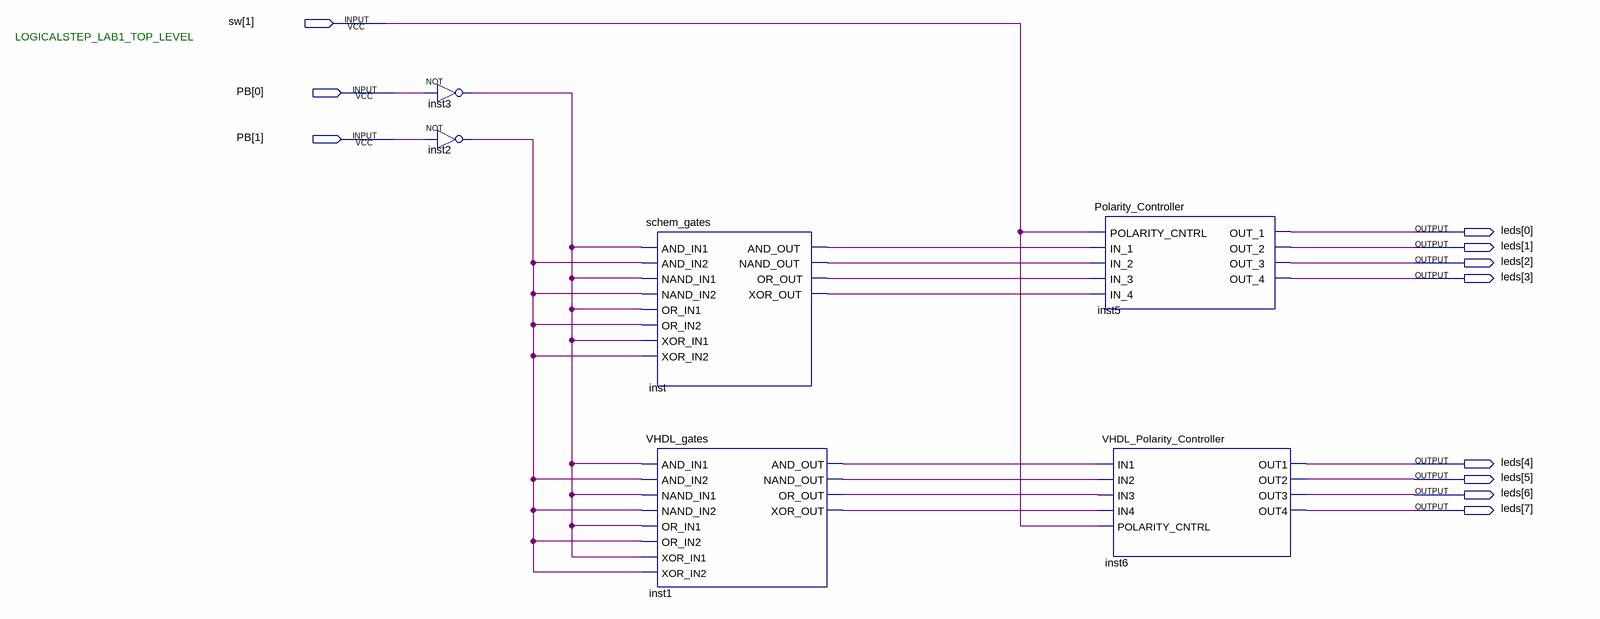
[diagram p0: schematic sheet]
// Quartus schematic LogicalStep_Lab1_top.bdf as structural Verilog: 6 symbols, 11 pins
module LogicalStep_Lab1_top (
  input  [1:1] sw,
  input  [1:0] PB,
  output [7:0] leds
);

  wire inst1_and_out, inst1_nand_out, inst1_or_out, inst1_xor_out, inst2_out, inst3_out, inst_and_out,
       inst_nand_out, inst_or_out, inst_xor_out;

  not inst3 (inst3_out, PB[0]);
  not inst2 (inst2_out, PB[1]);
  schem_gates inst (
    .AND_IN1(inst3_out), .AND_IN2(inst2_out), .NAND_IN1(inst3_out), .NAND_IN2(inst2_out), .OR_IN1(inst3_out),
    .OR_IN2(inst2_out), .XOR_IN1(inst3_out), .XOR_IN2(inst2_out), .AND_OUT(inst_and_out),
    .NAND_OUT(inst_nand_out), .OR_OUT(inst_or_out), .XOR_OUT(inst_xor_out));
  VHDL_gates inst1 (
    .AND_IN1(inst3_out), .AND_IN2(inst2_out), .NAND_IN1(inst3_out), .NAND_IN2(inst2_out), .OR_IN1(inst3_out),
    .OR_IN2(inst2_out), .XOR_IN1(inst3_out), .XOR_IN2(inst2_out), .AND_OUT(inst1_and_out),
    .NAND_OUT(inst1_nand_out), .OR_OUT(inst1_or_out), .XOR_OUT(inst1_xor_out));
  Polarity_Controller inst5 (
    .POLARITY_CNTRL(sw[1]), .IN_1(inst_and_out), .IN_2(inst_nand_out), .IN_3(inst_or_out),
    .IN_4(inst_xor_out), .OUT_1(leds[0]), .OUT_2(leds[1]), .OUT_3(leds[2]), .OUT_4(leds[3]));
  VHDL_Polarity_Controller inst6 (
    .IN1(inst1_and_out), .IN2(inst1_nand_out), .IN3(inst1_or_out), .IN4(inst1_xor_out),
    .POLARITY_CNTRL(sw[1]), .OUT1(leds[4]), .OUT2(leds[5]), .OUT3(leds[6]), .OUT4(leds[7]));

  // Notes on the sheet:
  //   LOGICALSTEP_LAB1_TOP_LEVEL
endmodule
